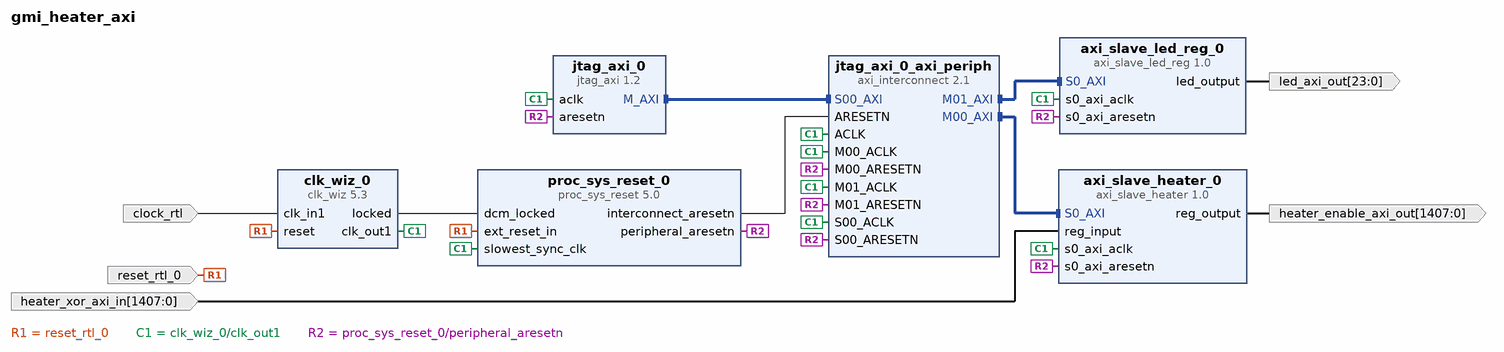
[diagram p0: block diagram of the top level]
# Vivado block design gmi_heater_axi, xcvu9p-flga2577-2-i-es1, Vivado 2016.4
create_bd_design gmi_heater_axi

create_bd_port -dir I -type rst reset_rtl_0
set_property -dict {CONFIG.POLARITY ACTIVE_HIGH} [get_bd_ports reset_rtl_0]
create_bd_port -dir I -type clk clock_rtl
set_property -dict {CONFIG.FREQ_HZ 125000000 CONFIG.PHASE 0.000} [get_bd_ports clock_rtl]
create_bd_port -dir I -from 1407 -to 0 heater_xor_axi_in
create_bd_port -dir O -from 1407 -to 0 heater_enable_axi_out
create_bd_port -dir O -from 23 -to 0 led_axi_out

create_bd_cell -type ip -vlnv xilinx.com:ip:clk_wiz:5.3 clk_wiz_0
set_property -dict [list \
  CONFIG.PRIM_IN_FREQ 125 \
  CONFIG.CLKIN1_JITTER_PS 80.0 \
  CONFIG.CLKOUT1_REQUESTED_OUT_FREQ 50 \
  CONFIG.MMCM_DIVCLK_DIVIDE 5 \
  CONFIG.MMCM_CLKFBOUT_MULT_F 48.000 \
  CONFIG.MMCM_CLKIN1_PERIOD 8.0 \
  CONFIG.MMCM_CLKOUT0_DIVIDE_F 24.000 \
  CONFIG.CLKOUT1_JITTER 196.543 \
  CONFIG.CLKOUT1_PHASE_ERROR 222.305 \
] [get_bd_cells clk_wiz_0]
create_bd_cell -type ip -vlnv xilinx.com:ip:proc_sys_reset:5.0 proc_sys_reset_0
set_property -dict {CONFIG.C_AUX_RESET_HIGH 0} [get_bd_cells proc_sys_reset_0]
create_bd_cell -type ip -vlnv xilinx.com:ip:jtag_axi:1.2 jtag_axi_0
create_bd_cell -type ip -vlnv user.org:user:axi_slave_led_reg:1.0 axi_slave_led_reg_0
create_bd_cell -type ip -vlnv xilinx.com:ip:axi_interconnect:2.1 jtag_axi_0_axi_periph
set_property -dict {CONFIG.NUM_MI 2} [get_bd_cells jtag_axi_0_axi_periph]
create_bd_cell -type ip -vlnv user.org:user:axi_slave_heater:1.0 axi_slave_heater_0

# ---- connections ----

connect_bd_intf_net [get_bd_intf_pins jtag_axi_0/M_AXI] [get_bd_intf_pins jtag_axi_0_axi_periph/S00_AXI]
connect_bd_intf_net [get_bd_intf_pins jtag_axi_0_axi_periph/M01_AXI] [get_bd_intf_pins axi_slave_led_reg_0/S0_AXI]
connect_bd_intf_net [get_bd_intf_pins jtag_axi_0_axi_periph/M00_AXI] [get_bd_intf_pins axi_slave_heater_0/S0_AXI]
connect_bd_net -net reset_rtl_0_1 [get_bd_ports reset_rtl_0] [get_bd_pins clk_wiz_0/reset] [get_bd_pins proc_sys_reset_0/ext_reset_in]
connect_bd_net [get_bd_ports clock_rtl] [get_bd_pins clk_wiz_0/clk_in1]
connect_bd_net [get_bd_pins clk_wiz_0/clk_out1] \
  [get_bd_pins jtag_axi_0/aclk] [get_bd_pins proc_sys_reset_0/slowest_sync_clk] [get_bd_pins axi_slave_led_reg_0/s0_axi_aclk] \
  [get_bd_pins jtag_axi_0_axi_periph/S00_ACLK] [get_bd_pins jtag_axi_0_axi_periph/ACLK] \
  [get_bd_pins jtag_axi_0_axi_periph/M00_ACLK] [get_bd_pins jtag_axi_0_axi_periph/M01_ACLK] \
  [get_bd_pins axi_slave_heater_0/s0_axi_aclk]
connect_bd_net [get_bd_pins proc_sys_reset_0/peripheral_aresetn] \
  [get_bd_pins jtag_axi_0/aresetn] [get_bd_pins axi_slave_led_reg_0/s0_axi_aresetn] \
  [get_bd_pins jtag_axi_0_axi_periph/S00_ARESETN] [get_bd_pins jtag_axi_0_axi_periph/M00_ARESETN] \
  [get_bd_pins jtag_axi_0_axi_periph/M01_ARESETN] [get_bd_pins axi_slave_heater_0/s0_axi_aresetn]
connect_bd_net [get_bd_pins clk_wiz_0/locked] [get_bd_pins proc_sys_reset_0/dcm_locked]
connect_bd_net [get_bd_pins proc_sys_reset_0/interconnect_aresetn] [get_bd_pins jtag_axi_0_axi_periph/ARESETN]
connect_bd_net [get_bd_pins axi_slave_led_reg_0/led_output] [get_bd_ports led_axi_out]
connect_bd_net [get_bd_pins axi_slave_heater_0/reg_output] [get_bd_ports heater_enable_axi_out]
connect_bd_net [get_bd_ports heater_xor_axi_in] [get_bd_pins axi_slave_heater_0/reg_input]

# ---- address map ----
assign_bd_address -offset 0x44A00000 -range 64K -target_address_space [get_bd_addr_spaces jtag_axi_0/Data] [get_bd_addr_segs axi_slave_heater_0/S0_AXI/S0_AXI_reg]
assign_bd_address -offset 0x44A10000 -range 64K -target_address_space [get_bd_addr_spaces jtag_axi_0/Data] [get_bd_addr_segs axi_slave_led_reg_0/S0_AXI/S0_AXI_reg]

validate_bd_design
save_bd_design
